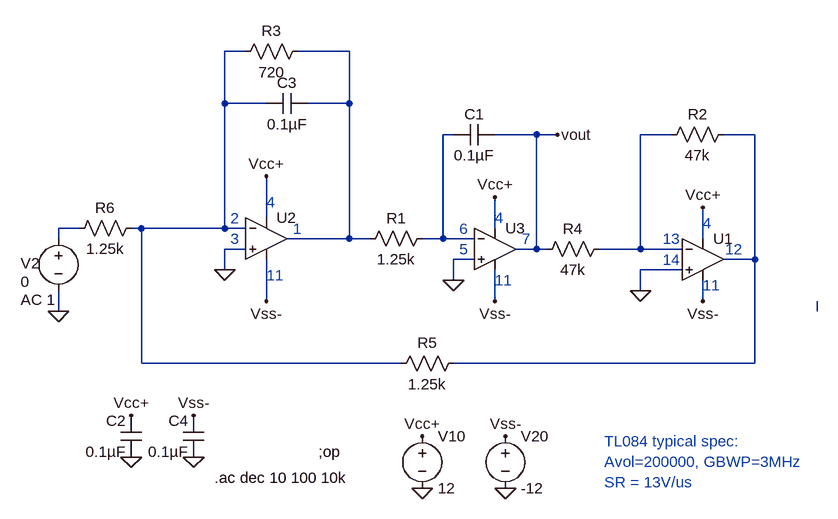
[diagram p0: schematic x7620_template.asc]
x7620_template.asc, the LTspice schematic file:
Version 4
SHEET 1 880 680
WIRE -800 -208 -832 -208
WIRE -640 -208 -720 -208
WIRE -832 -128 -832 -208
WIRE -768 -128 -832 -128
WIRE -640 -128 -640 -208
WIRE -640 -128 -704 -128
WIRE -480 -80 -496 -80
WIRE -352 -80 -416 -80
WIRE -320 -80 -352 -80
WIRE -144 -80 -192 -80
WIRE -16 -80 -64 -80
WIRE -768 48 -768 -16
WIRE -1056 64 -1088 64
WIRE -960 64 -976 64
WIRE -832 64 -832 -128
WIRE -832 64 -960 64
WIRE -800 64 -832 64
WIRE -416 64 -416 16
WIRE -1088 80 -1088 64
WIRE -640 80 -640 -128
WIRE -640 80 -736 80
WIRE -608 80 -640 80
WIRE -496 80 -496 -80
WIRE -496 80 -528 80
WIRE -448 80 -496 80
WIRE -96 80 -96 32
WIRE -800 96 -832 96
WIRE -352 96 -352 -80
WIRE -352 96 -384 96
WIRE -336 96 -352 96
WIRE -192 96 -192 -80
WIRE -192 96 -256 96
WIRE -128 96 -192 96
WIRE -448 112 -480 112
WIRE -16 112 -16 -80
WIRE -16 112 -64 112
WIRE -832 128 -832 96
WIRE -128 128 -192 128
WIRE -480 144 -480 112
WIRE -192 160 -192 128
WIRE -768 176 -768 112
WIRE -416 176 -416 128
WIRE -96 176 -96 144
WIRE -1088 192 -1088 160
WIRE 80 192 80 176
WIRE -960 272 -960 64
WIRE -560 272 -960 272
WIRE -16 272 -16 112
WIRE -16 272 -480 272
FLAG -1088 192 0
FLAG -528 464 0
FLAG -400 464 0
FLAG -528 384 Vcc+
FLAG -400 384 Vss-
FLAG -96 176 Vss-
FLAG -320 -80 vout
FLAG -768 -16 Vcc+
FLAG -768 176 Vss-
FLAG -832 128 0
FLAG -480 144 0
FLAG -96 32 Vcc+
FLAG -416 16 Vcc+
FLAG -192 160 0
FLAG -416 176 Vss-
FLAG -880 416 0
FLAG -976 416 0
FLAG -880 352 Vss-
FLAG -976 352 Vcc+
SYMBOL voltage -528 368 R0
WINDOW 123 0 0 Left 2
WINDOW 39 0 0 Left 2
SYMATTR InstName V10
SYMATTR Value 12
SYMBOL voltage -400 368 R0
WINDOW 123 0 0 Left 2
WINDOW 39 0 0 Left 2
SYMATTR InstName V20
SYMATTR Value -12
SYMBOL voltage -1088 64 R0
WINDOW 0 -58 54 Left 2
WINDOW 3 -58 82 Left 2
WINDOW 123 -58 110 Left 2
WINDOW 39 0 0 Left 2
SYMATTR InstName V2
SYMATTR Value 0
SYMATTR Value2 AC 1
SYMBOL Opamps\\UniversalOpamp2 -768 80 R0
SYMATTR InstName U2
SYMATTR Value2 Avol=200000 GBW=3Meg Slew=13Meg
SYMBOL Opamps\\UniversalOpamp2 -96 112 R0
SYMATTR InstName U1
SYMATTR Value2 Avol=200000 GBW=3Meg Slew=13Meg
SYMBOL res -48 -96 R90
WINDOW 0 0 56 VBottom 2
WINDOW 3 32 56 VTop 2
SYMATTR InstName R2
SYMATTR Value 47k
SYMBOL res -240 80 R90
WINDOW 0 0 56 VBottom 2
WINDOW 3 32 56 VTop 2
SYMATTR InstName R4
SYMATTR Value 47k
SYMBOL Opamps\\UniversalOpamp2 -416 96 R0
SYMATTR InstName U3
SYMATTR Value2 Avol=200000 GBW=3Meg Slew=13Meg
SYMBOL res -512 64 R90
WINDOW 0 0 56 VBottom 2
WINDOW 3 32 56 VTop 2
SYMATTR InstName R1
SYMATTR Value 1.25k
SYMBOL cap -704 -144 R90
WINDOW 0 0 32 VBottom 2
WINDOW 3 32 32 VTop 2
SYMATTR InstName C3
SYMATTR Value 0.1µF
SYMBOL res -704 -224 R90
WINDOW 0 0 56 VBottom 2
WINDOW 3 32 56 VTop 2
SYMATTR InstName R3
SYMATTR Value 720
SYMBOL res -464 256 R90
WINDOW 0 0 56 VBottom 2
WINDOW 3 32 56 VTop 2
SYMATTR InstName R5
SYMATTR Value 1.25k
SYMBOL res -960 48 R90
WINDOW 0 0 56 VBottom 2
WINDOW 3 32 56 VTop 2
SYMATTR InstName R6
SYMATTR Value 1.25k
SYMBOL cap -416 -96 R90
WINDOW 0 0 32 VBottom 2
WINDOW 3 32 32 VTop 2
SYMATTR InstName C1
SYMATTR Value 0.1µF
SYMBOL cap -960 416 R180
WINDOW 0 24 56 Left 2
WINDOW 3 24 8 Left 2
SYMATTR InstName C2
SYMATTR Value 0.1µF
SYMBOL cap -864 416 R180
WINDOW 0 24 56 Left 2
WINDOW 3 24 8 Left 2
SYMATTR InstName C4
SYMATTR Value 0.1µF
TEXT -688 408 Left 2 !;op
TEXT -848 448 Left 2 !.ac dec 10 100 10k
TEXT -248 392 Left 2 ;TL084 typical spec:\nAvol=200000, GBWP=3MHz\nSR = 13V/us
TEXT -816 64 Bottom 2 ;2
TEXT -816 96 Bottom 2 ;3
TEXT -720 80 Bottom 2 ;1
TEXT -768 24 Left 2 ;4
TEXT -768 136 Left 2 ;11
TEXT -416 48 Left 2 ;4
TEXT -96 56 Left 2 ;4
TEXT -416 144 Left 2 ;11
TEXT -96 152 Left 2 ;11
TEXT -464 80 Bottom 2 ;6
TEXT -464 112 Bottom 2 ;5
TEXT -368 96 Bottom 2 ;7
TEXT -144 96 Bottom 2 ;13
TEXT -144 128 Bottom 2 ;14
TEXT -48 112 Bottom 2 ;12

The netlist it stands for:
* x7620_template.asc
V10 Vcc+ 0 12
V20 Vss- 0 -12
V2 N006 0 0 AC 1
XU2 0 N001 Vcc+ Vss- N002 level.2 Avol=200000 GBW=3Meg Slew=13Meg ilimit=25m rail=0 Vos=0 phimargin=45 en=0 enk=0 in=0 ink=0 Rin=500Meg  ; pins IN+ IN- V+ V- OUT
XU1 0 N004 Vcc+ Vss- N005 level.2 Avol=200000 GBW=3Meg Slew=13Meg ilimit=25m rail=0 Vos=0 phimargin=45 en=0 enk=0 in=0 ink=0 Rin=500Meg  ; pins IN+ IN- V+ V- OUT
R2 N005 N004 47k
R4 N004 vout 47k
XU3 0 N003 Vcc+ Vss- vout level.2 Avol=200000 GBW=3Meg Slew=13Meg ilimit=25m rail=0 Vos=0 phimargin=45 en=0 enk=0 in=0 ink=0 Rin=500Meg  ; pins IN+ IN- V+ V- OUT
R1 N003 N002 1.25k
C3 N002 N001 0.1µF
R3 N002 N001 720
R5 N005 N001 1.25k
R6 N001 N006 1.25k
C1 vout N003 0.1µF
C2 0 Vcc+ 0.1µF
C4 0 Vss- 0.1µF
;op
.ac dec 10 100 10k
* TL084 typical spec:
* Avol=200000, GBWP=3MHz
* SR = 13V/us
* 2
* 3
* 1
* 4
* 11
* 4
* 4
* 11
* 11
* 6
* 5
* 7
* 13
* 14
* 12
.lib UniversalOpamps2.sub
.backanno
.end